# Altium schematic sheet Sheet1.SchDoc
size A; SheetNumber: 1; SheetTotal: 1
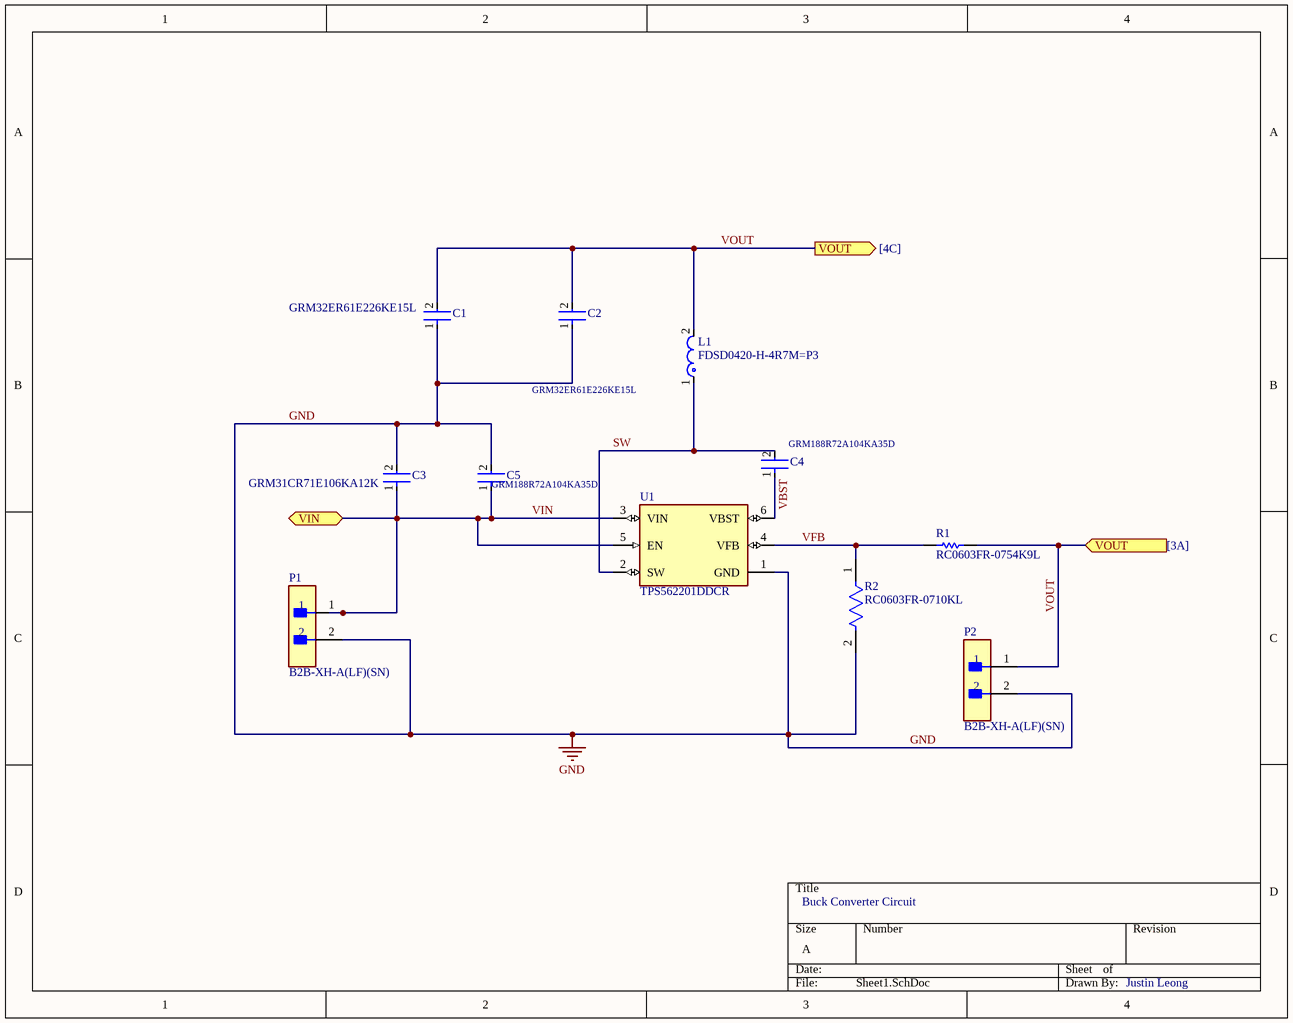
[diagram p0: Sheet1.SchDoc]

## Parts
C1  GRM32ER61E226KE15L  [FP-GRM32-MFG]
C2  GRM32ER61E226KE15L  [FP-GRM32-MFG]
C3  GRM31CR71E106KA12K  [FP-GRM31C-0_2-e0_3_0_8-MFG]
C4  GRM188R72A104KA35D  [FP-GRM188-0_1-e0_2_0_5-IPC_B]
C5  GRM188R72A104KA35D  [FP-GRM188-0_1-e0_2_0_5-IPC_B]
L1  FDSD0420-H-4R7M=P3  [FP-FDSD0420-MFG]
P1  B2B-XH-A(LF)(SN)  [FP-B2B-XH-A_LF_SN-MFG]
P2  B2B-XH-A(LF)(SN)  [FP-B2B-XH-A_LF_SN-MFG]
R1  RC0603FR-0754K9L  [RESC1608X55X25NL10T15]
R2  RC0603FR-0710KL  [FP-RC0603-0_55-IPC_C]
U1  TPS562201DDCR  [FP-DDC0006A-IPC_C]

## Ports
VIN (bidir), VOUT (in, see [3A]), VOUT (out, see [4C])

## Nets
GND: C1.1 C2.1 C3.2 C5.2 P1.2 P2.2 R2.2 U1.1(GND)
SW: C4.2 L1.1 U1.2(SW)
VBST: C4.1 U1.6(VBST)
VFB: R1.1 R2.1 U1.4(VFB)
VIN: C3.1 C5.1 P1.1 U1.3(VIN) U1.5(EN) ; port VIN
VOUT: C1.2 C2.2 L1.2 P2.1 R1.2 ; port VOUT

## Notes on the sheet
- Buck Converter Circuit
- Justin Leong

## Library data of the parts
C1 C2 = CMP-2000-05458-2: CAP CER 22UF 25V X5R 1210; Manufacturer: Murata Electronics North America; Possible Substitute: GRM32ER61E226KE15K; Other Names: 490-3889-2; Material: Ceramic; Tolerance: 10%; Digikey Description: CAP CER 22UF 25V X5R 1210; Mouser Description: Multilayer Ceramic Capacitors MLCC - SMD/SMT 1210 22uF 25volts X5R 10%; Device Class L2: Capacitors; Height: 2.7mm; Temperature Characteristic: X5R; Category: Cap; RoHS: TRUE; Operating Temperature: -55°C ~ 85°C; Temperature: -55°C to +85°C; Lead Free: Yes; Package: GRM32; Temperature Range High: +85°C; Package / Case: 1210 (3225 Metric); Standard Package: 1,000; Packaging: Cut Tape (CT); Capacitance: 22uF; Thickness (Max): 0.106" (2.70mm); Value: 22uF; Automotive: No; Device Class L1: Passive Components; Voltage - Rated: 25V; Temperature Range Low: -55°C; Size / Dimension: 0.126" L x 0.098" W (3.20mm x 2.50mm); ComponentLink2Description: Datasheet; Device Class L3: Ceramic Capacitors; Temperature Coefficient: X5R; ComponentLink2URL: https://search.murata.co.jp/Ceramy/image/img/A01X/G101/ENG/GRM32ER61E226KE15-01A.pdf; Voltage Rating: 25V; Manufacturer Part Number: GRM32ER61E226KE15L; Octopart: https://octopart.com/grm32er61e226ke15l-murata-197441; Applications: General Purpose; Mounting Type: Surface Mount, MLCC
C3 = CMP-06035-005515-1: Chip Multilayer Ceramic Capacitors for General Purpose, 1206, 10uF, X7R, 15%, 10%, 25V; Dielectric: X7R; Max Operating Temperature: 125°C; Capacitance: 10uF; Voltage Rating (DC): 25V; Case/Package: 1206; Thickness: 0.071inch; Tolerance: 10%; Voltage Rating: 25V; Mount: Surface Mount; Width: 0.063inch; Length: 0.126inch; Min Operating Temperature: -55°C; Packaging: Tape and Reel; Lead Free: Lead Free; Voltage: 25V
C4 C5 = CMP-1035-02595-8: Chip Multilayer Ceramic Capacitors for General Purpose, 0603, 0.10uF, X7R, 15%, 10%, 100V; Capacitance: 100nF; Voltage Rating (DC): 100V; Material: Ceramic; Packaging: Tape and Reel; Dielectric: X7R; Case Code (Imperial): 0603; Package Quantity: 1; Height: 0.8mm; Weight: 0.000222oz; Min Operating Temperature: -55°C; Depth: 0.8mm; Mount: Surface Mount; Thickness: 0.035inch; Voltage: 100V; REACH SVHC: No SVHC; Case/Package: 0603; Voltage Rating: 100V; Width: 0.8mm; Tolerance: 10%; Lead Free: Lead Free; Case Code (Metric): 1608; Radiation Hardening: No; Max Operating Temperature: 125°C; Termination: SMD/SMT; Length: 1.6mm
L1 = CMP-06042-016333-1: FIXED IND 4.7UH 2.7A 83 MOHM SMD; Shielding: Shielded; Tolerance: 20%; Core Material: Ferrite; Saturation Current: 3.6A; Test Frequency: 100kHz; DC Resistance (DCR): 83mR; Packaging: Tape and Reel; Inductance: 4.7uH; Mount: Surface Mount; RoHS Compliant: Yes; Length: 0.165inch; Resistor Type: Wirewound; Width: 0.165inch; Max DC Current: 2.7A; Current Rating: 2.7A; Height - Seated (Max): 0.078inch; Case/Package: Nonstandard
P1 P2 = CMP-2000-05888-3: CONN HEADER VERT 2POS 2.5MM; Current Rating: 3A; Voltage Rating: 250V; Number of Contacts: 2; Contact Resistance: 20mR; Wire/Cable Gauge: 22AWG; Insulation Resistance: 1GR; Connector Type: Male Pin; Packaging: Bulk; Contact Material: Brass; Lead Free: Lead Free; Orientation: Straight; Contact Plating: Tin; Max Current Rating: 3A; Termination: Solder; Fastening Type: Detent; Depth: 5.75mm; Housing Material: Polyamide; REACH SVHC: No SVHC; Series: XH; Voltage Rating (AC): 250V; Number of Positions: 2; Color: Natural; Contact Type: Male Pin; Max Voltage Rating (DC): 250V; Pitch: 2.5mm; Lead Pitch: 2.5mm; Mount: Through Hole; Max Operating Temperature: 85°C; Length: 7.4mm; Max Voltage Rating (AC): 250V; Min Operating Temperature: -25°C; Number of Rows: 1; Housing Color: White
R1 = CMP-2000-04083-1: Manufacturer: Yageo; Part Number: RC0603FR-0754K9L
R2 = CMP-2100-03664-2: RES 10K OHM 1% 1/10W 0603; Voltage Rating: 75V; Voltage Rating (DC): 50V; Resistance: 10kR; Power Rating: 100mW; Temperature Coefficient: 100ppm/°C; Depth: 0.8mm; Termination: SMD/SMT; Resistor Type: Thick Film; Series: RC; Construction: Rectangular; Features: Moisture Resistant; Packaging: Tape and Reel; Min Operating Temperature: -55°C; Number of Terminations: 2; Lead Pitch: 0.3mm; RoHS Compliant: Yes; Case/Package: 0603; Resistance Tolerance: 1%; Military Standard: Not; Weight: 7.1E-05oz; Number of Pins: 2; Tolerance: 1%; Length: 1.6mm; Case Code (Imperial): 0603; Lead Free: Lead Free; Width: 0.8mm; Max Power Dissipation: 100mW; Height: 0.45mm; Max Operating Temperature: 155°C; Case Code (Metric): 1608; Size Code: 0603
U1 = CMP-031-00006-1: Buck Yes 580KHz Adjustable 1 7V 768mV 17V 4.5V SOT-23-THIN SMD mount 1.1mm(height); Min Supply Voltage: 4.5V; Mounting Technology: Surface Mount; Pins: 6; Max Supply Voltage: 17V; Max Operating Temperature: 125°C; Min Operating Temperature: -40°C; Case/Package: SOT